# EAGLE design R107 (EAGLE 6.6.0)
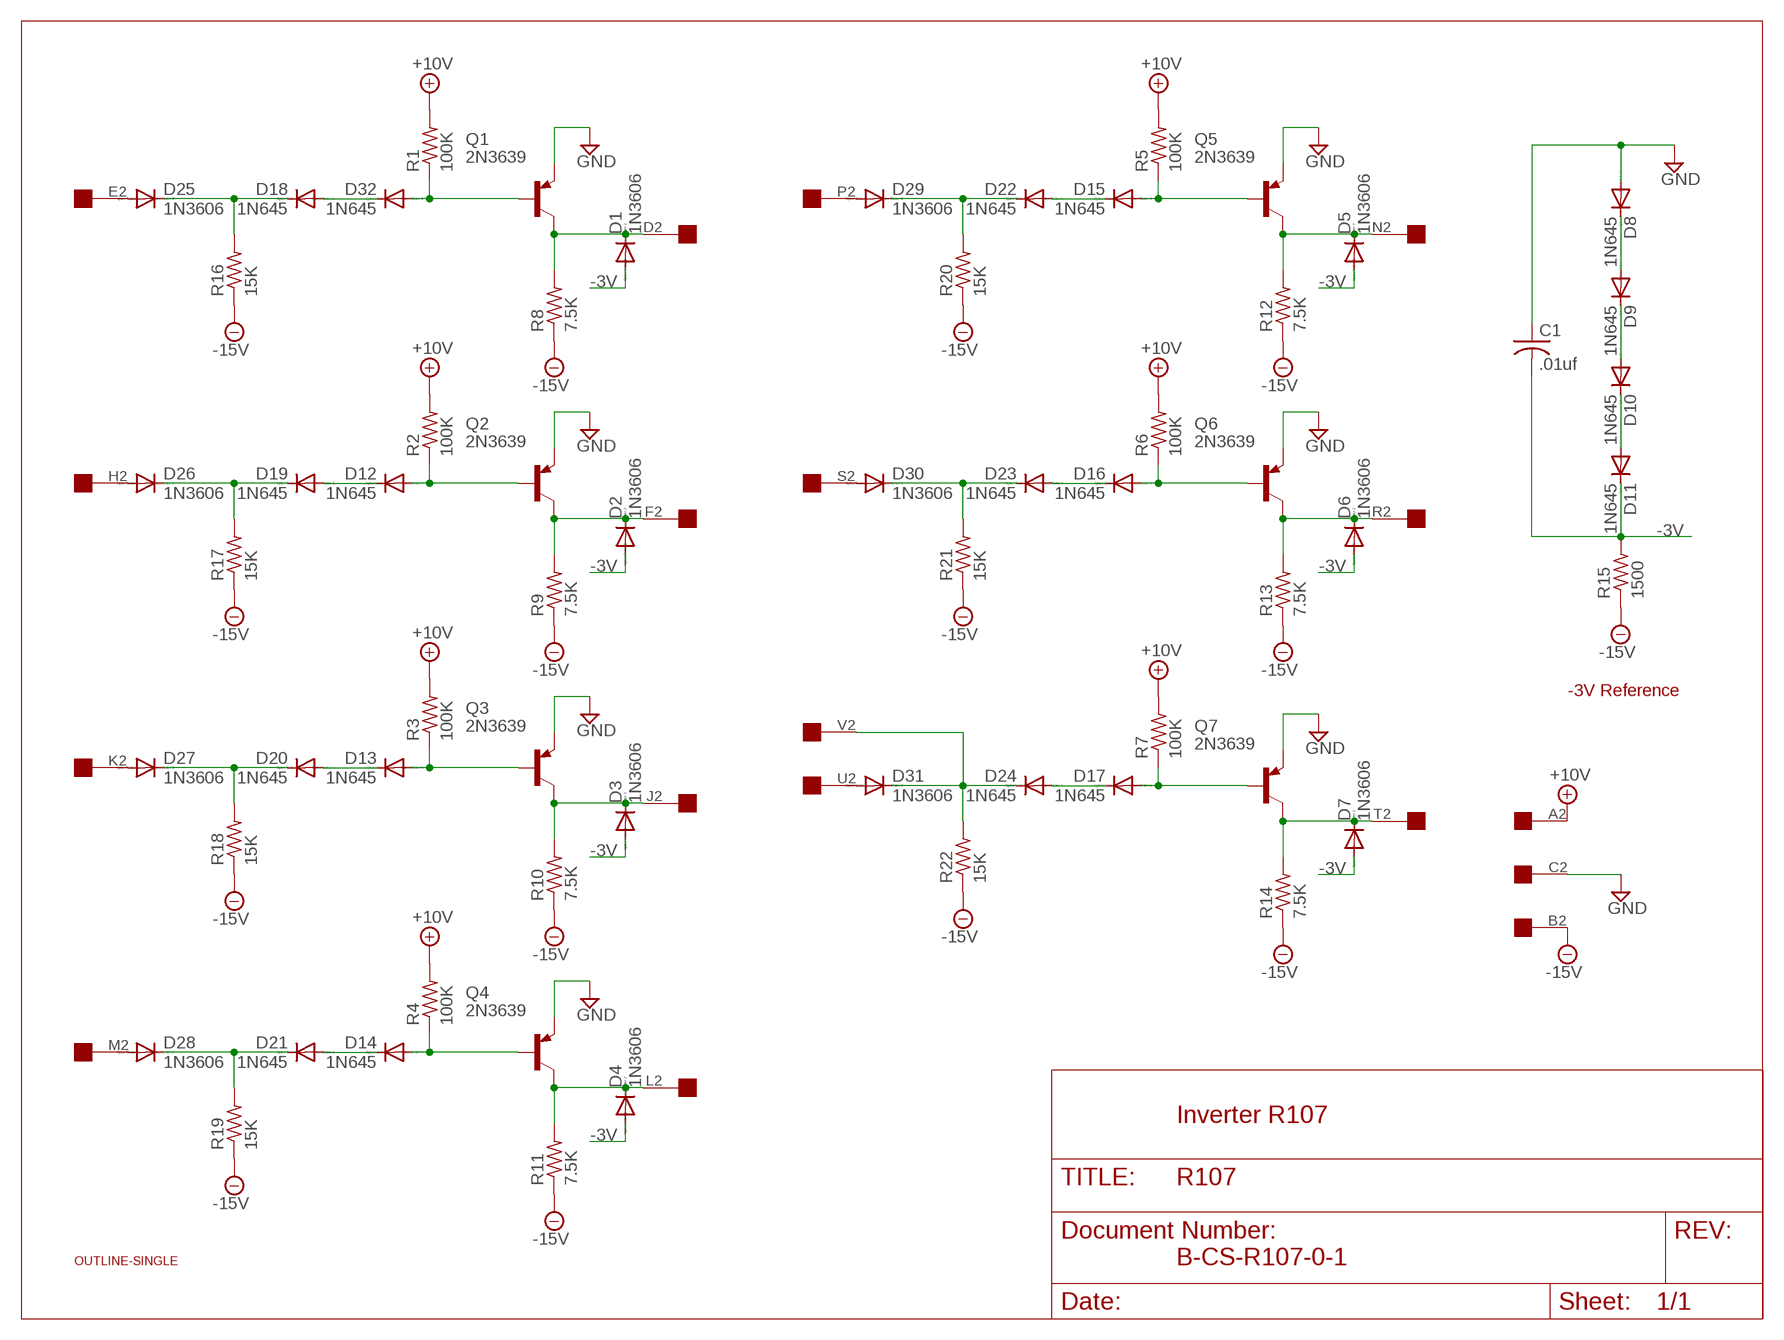
[diagram p0: schematic, sheet 1]

## Parts
C1  .01uf  C-US050-025X075  [C050-025X075]
D1  1N3606  1N4148DO35-10  [DO35-10]
D2  1N3606  1N4148DO35-10  [DO35-10]
D3  1N3606  1N4148DO35-10  [DO35-10]
D4  1N3606  1N4148DO35-10  [DO35-10]
D5  1N3606  1N4148DO35-10  [DO35-10]
D6  1N3606  1N4148DO35-10  [DO35-10]
D7  1N3606  1N4148DO35-10  [DO35-10]
D8  1N645  1N4148DO35-10  [DO35-10]
D9  1N645  1N4148DO35-10  [DO35-10]
D10  1N645  1N4148DO35-10  [DO35-10]
D11  1N645  1N4148DO35-10  [DO35-10]
D12  1N645  1N4148DO35-10  [DO35-10]
D13  1N645  1N4148DO35-10  [DO35-10]
D14  1N645  1N4148DO35-10  [DO35-10]
D15  1N645  1N4148DO35-10  [DO35-10]
D16  1N645  1N4148DO35-10  [DO35-10]
D17  1N645  1N4148DO35-10  [DO35-10]
D18  1N645  1N4148DO35-10  [DO35-10]
D19  1N645  1N4148DO35-10  [DO35-10]
D20  1N645  1N4148DO35-10  [DO35-10]
D21  1N645  1N4148DO35-10  [DO35-10]
D22  1N645  1N4148DO35-10  [DO35-10]
D23  1N645  1N4148DO35-10  [DO35-10]
D24  1N645  1N4148DO35-10  [DO35-10]
D25  1N3606  1N4148DO35-10  [DO35-10]
D26  1N3606  1N4148DO35-10  [DO35-10]
D27  1N3606  1N4148DO35-10  [DO35-10]
D28  1N3606  1N4148DO35-10  [DO35-10]
D29  1N3606  1N4148DO35-10  [DO35-10]
D30  1N3606  1N4148DO35-10  [DO35-10]
D31  1N3606  1N4148DO35-10  [DO35-10]
D32  1N645  1N4148DO35-10  [DO35-10]
Q1  2N3639  2N3637  [TO39]
Q2  2N3639  2N3637  [TO39]
Q3  2N3639  2N3637  [TO39]
Q4  2N3639  2N3637  [TO39]
Q5  2N3639  2N3637  [TO39]
Q6  2N3639  2N3637  [TO39]
Q7  2N3639  2N3637  [TO39]
R1  100K  R-US_0207/10  [0207/10]
R2  100K  R-US_0207/10  [0207/10]
R3  100K  R-US_0207/10  [0207/10]
R4  100K  R-US_0207/10  [0207/10]
R5  100K  R-US_0207/10  [0207/10]
R6  100K  R-US_0207/10  [0207/10]
R7  100K  R-US_0207/10  [0207/10]
R8  7.5K  R-US_0207/10  [0207/10]
R9  7.5K  R-US_0207/10  [0207/10]
R10  7.5K  R-US_0207/10  [0207/10]
R11  7.5K  R-US_0207/10  [0207/10]
R12  7.5K  R-US_0207/10  [0207/10]
R13  7.5K  R-US_0207/10  [0207/10]
R14  7.5K  R-US_0207/10  [0207/10]
R15  1500  R-US_0207/10  [0207/10]
R16  15K  R-US_0207/10  [0207/10]
R17  15K  R-US_0207/10  [0207/10]
R18  15K  R-US_0207/10  [0207/10]
R19  15K  R-US_0207/10  [0207/10]
R20  15K  R-US_0207/10  [0207/10]
R21  15K  R-US_0207/10  [0207/10]
R22  15K  R-US_0207/10  [0207/10]
U$1  OUTLINE-SINGLE  [SINGLE]
U$2  EDGE-1  [EDGE-CON1]

## Nets
+10V [Power]: R1.2 R2.2 R3.2 R4.2 R5.2 R6.2 R7.2 U$2.A2
-3V [Power]: C1.2 D1.A D2.A D3.A D4.A D5.A D6.A D7.A D11.C R15.2
-15V [Power]: R8.1 R9.1 R10.1 R11.1 R12.1 R13.1 R14.1 R15.1 R16.1 R17.1 R18.1 R19.1 R20.1 R21.1 R22.1 U$2.B2
GND [Power]: C1.1 D8.A Q1.1(E) Q2.1(E) Q3.1(E) Q4.1(E) Q5.1(E) Q6.1(E) Q7.1(E) U$2.C2
N$1: D7.C Q7.3(C) R14.2 U$2.T2
N$2: D12.A Q2.2(B) R2.1
N$3: D8.C D9.A
N$4: D2.C Q2.3(C) R9.2 U$2.F2
N$5: D26.A U$2.H2
N$6: D19.C D26.C R17.2
N$7: D12.C D19.A
N$8: D13.A Q3.2(B) R3.1
N$9: D3.C Q3.3(C) R10.2 U$2.J2
N$10: D27.A U$2.K2
N$11: D20.C D27.C R18.2
N$12: D13.C D20.A
N$13: D9.C D10.A
N$14: D31.A U$2.U2
N$15: D17.A Q7.2(B) R7.1
N$16: D10.C D11.A
N$17: D24.C D31.C R22.2 U$2.V2
N$18: D17.C D24.A
N$19: D32.A Q1.2(B) R1.1
N$20: D1.C Q1.3(C) R8.2 U$2.D2
N$21: D25.A U$2.E2
N$22: D18.C D25.C R16.2
N$23: D18.A D32.C
N$24: D14.A Q4.2(B) R4.1
N$25: D4.C Q4.3(C) R11.2 U$2.L2
N$26: D28.A U$2.M2
N$27: D21.C D28.C R19.2
N$28: D14.C D21.A
N$29: D15.A Q5.2(B) R5.1
N$30: D5.C Q5.3(C) R12.2 U$2.N2
N$31: D29.A U$2.P2
N$32: D22.C D29.C R20.2
N$33: D15.C D22.A
N$34: D16.A Q6.2(B) R6.1
N$35: D6.C Q6.3(C) R13.2 U$2.R2
N$36: D30.A U$2.S2
N$37: D23.C D30.C R21.2
N$38: D16.C D23.A

## Notes on the sheet
- -3V Reference
- Inverter R107
- B-CS-R107-0-1

## Library data of the parts
C1 = rcl:C-US: CAPACITOR, American symbol
D1-D32 = diode:1N4148: DIODE high speed (Philips)
Q1-Q7 = transistor-pnp:2N3637*: PNP Transistror
R1-R22 = rcl:R-US_: RESISTOR, American symbol
U$1 = dec-con:OUTLINE-*: Board outlines for DEC boards.
U$2 = dec-con:EDGE-1: Single-Sided DEC Edge Connector -- (side 2)

## Net classes
1 Power: width 0.813 mm

## Board
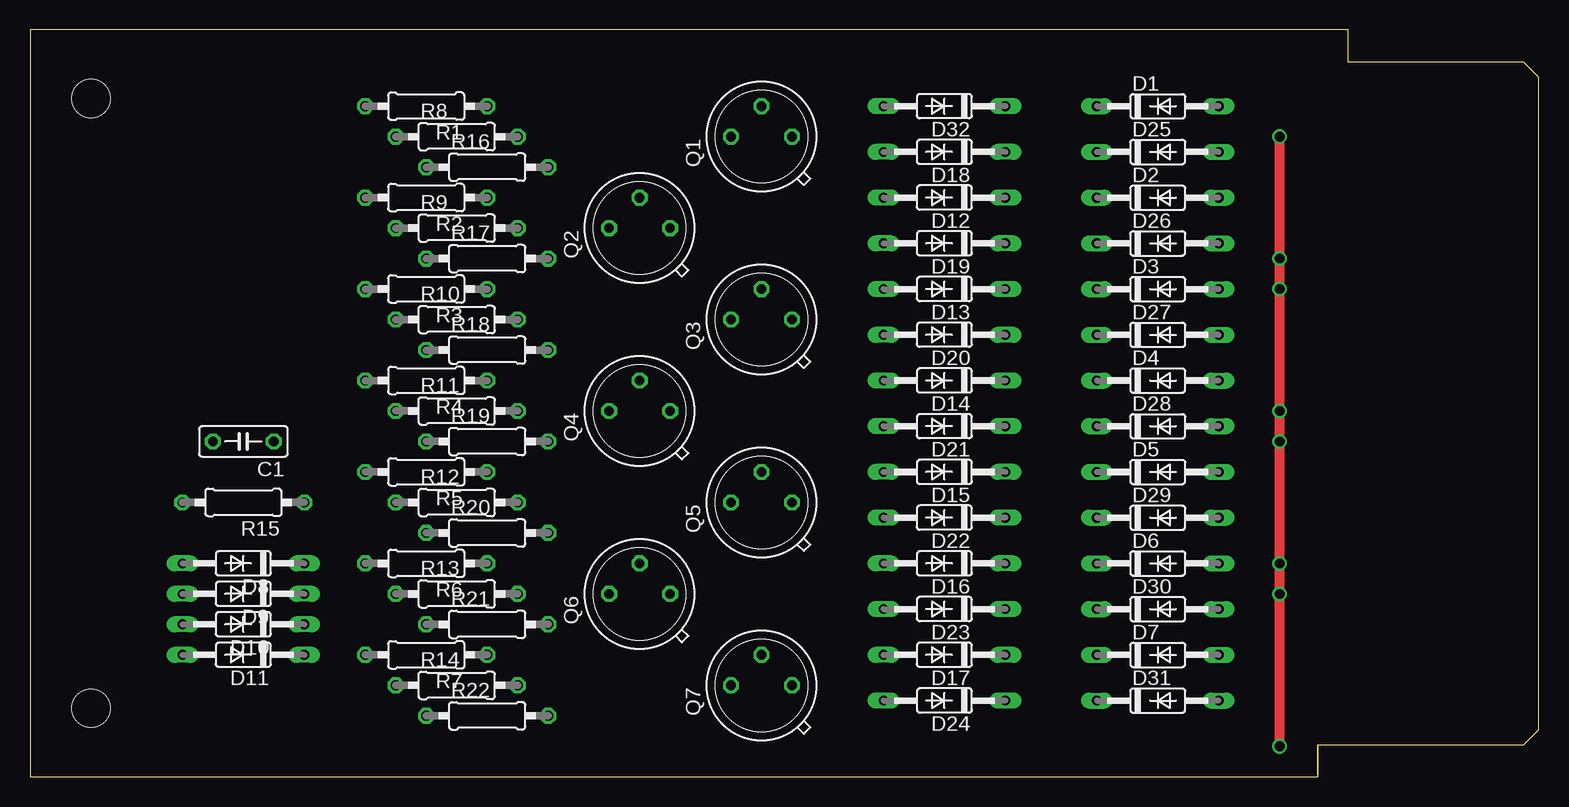
[diagram p1: board, top side]
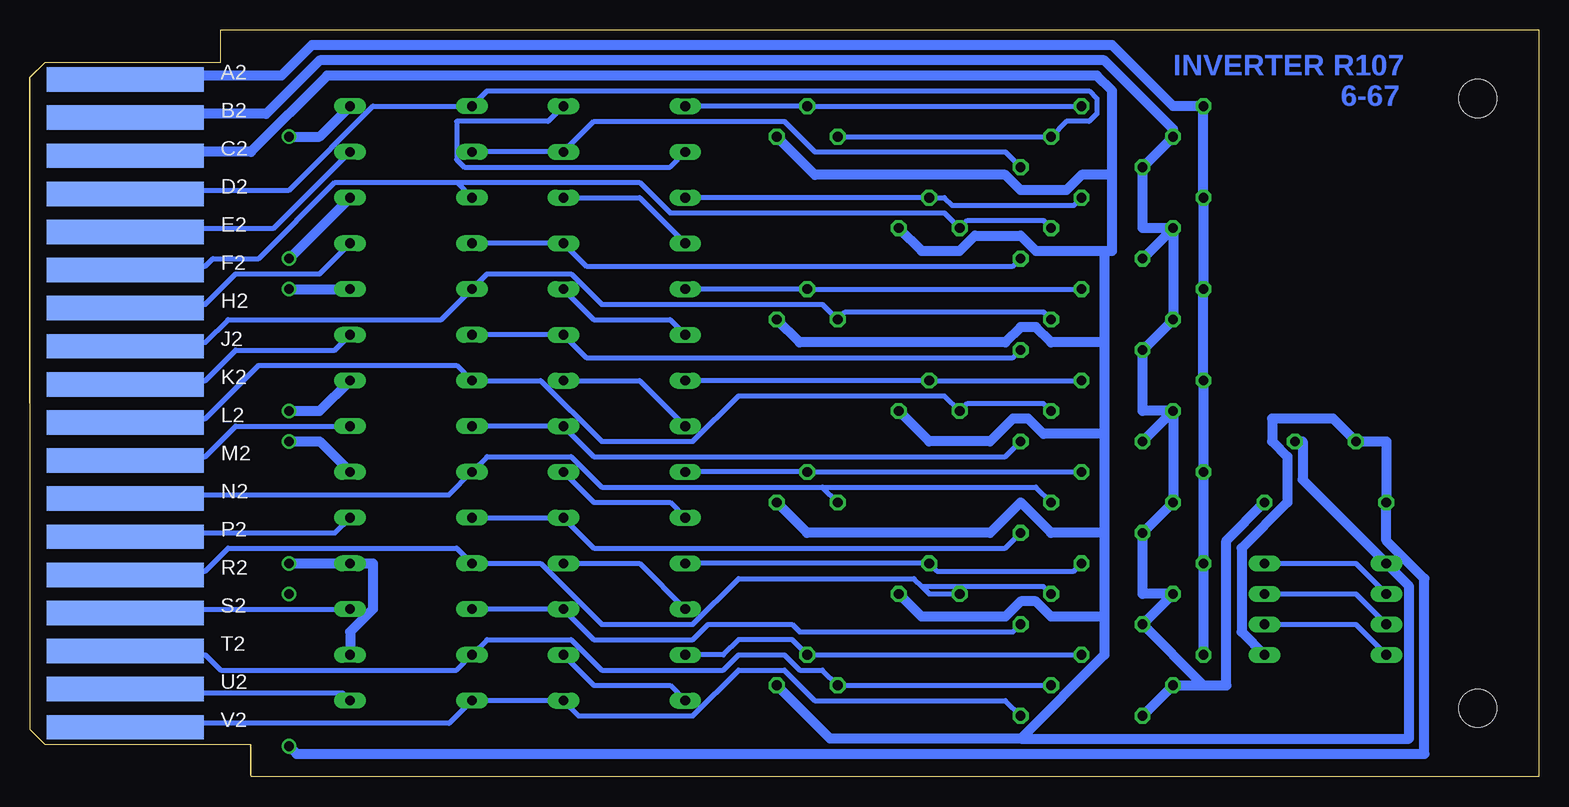
[diagram p2: board, bottom side, seen from below]

Size 125.73 x 62.23 mm. Coordinates in mm from the lower left corner, seen from the top.
Copper layers (1+16): Top 0.035mm / dielectric 1.5mm / Bottom 0.035mm
Design rules "16mils": minimum track width 16mil, minimum drill 32mil, track to track 15mil, track to pad 10mil, pad to pad 10mil, via to via 10mil, smd to smd 10mil, copper to edge 13mil, drill to drill 10mil, minimum pad ring 10mil, minimum via ring 8mil, stop-mask expansion 0mil, vias tented up to drill 0mil, thermal gap 10mil

### Footprints (pad centres in the part's own frame; a part is rotated, then mirrored left to right if it is on the bottom)
C050-025X075 = drill 0.813 octagon: 1 -2.54,0; 2 2.54,0
DO35-10 = drill 0.813 long: A 5.08,0; C -5.08,0
TO39 = drill 0.813 octagon: 1 0,-2.54; 2 2.54,0; 3 0,2.54
0207/10 = drill 0.813 octagon: 1 -5.08,0; 2 5.08,0
SINGLE = hole 3.175: 120.65,56.515; 120.65,5.715
EDGE-CON1 = smd 13.106 x 2.032 bottom: A2 7.938,4.128; B2 7.938,7.303; C2 7.938,10.477; D2 7.938,13.652; E2 7.938,16.828; F2 7.938,20.003; H2 7.938,23.177; J2 7.938,26.352; K2 7.938,29.527; L2 7.938,32.703; M2 7.938,35.877; N2 7.938,39.053; P2 7.938,42.227; R2 7.938,45.403; S2 7.938,48.578; T2 7.938,51.752; U2 7.938,54.928; V2 7.938,58.102

### Placement (x,y rotation side)
C1  17.78,27.94 180 top
D1  93.98,55.88 0 top
D2  93.98,48.26 0 top
D3  93.98,40.64 0 top
D4  93.98,33.02 0 top
D5  93.98,25.4 0 top
D6  93.98,17.78 0 top
D7  93.98,10.16 0 top
D8  17.78,17.78 180 top
D9  17.78,15.24 180 top
D10  17.78,12.7 180 top
D11  17.78,10.16 180 top
D12  76.2,48.26 180 top
D13  76.2,40.64 180 top
D14  76.2,33.02 180 top
D15  76.2,25.4 180 top
D16  76.2,17.78 180 top
D17  76.2,10.16 180 top
D18  76.2,52.07 180 top
D19  76.2,44.45 180 top
D20  76.2,36.83 180 top
D21  76.2,29.21 180 top
D22  76.2,21.59 180 top
D23  76.2,13.97 180 top
D24  76.2,6.35 180 top
D25  93.98,52.07 0 top
D26  93.98,44.45 0 top
D27  93.98,36.83 0 top
D28  93.98,29.21 0 top
D29  93.98,21.59 0 top
D30  93.98,13.97 0 top
D31  93.98,6.35 0 top
D32  76.2,55.88 180 top
Q1  60.96,53.34 90 top
Q2  50.8,45.72 90 top
Q3  60.96,38.1 90 top
Q4  50.8,30.48 90 top
Q5  60.96,22.86 90 top
Q6  50.8,15.24 90 top
Q7  60.96,7.62 90 top
R1  33.02,55.88 180 top
R2  33.02,48.26 180 top
R3  33.02,40.64 180 top
R4  33.02,33.02 180 top
R5  33.02,25.4 180 top
R6  33.02,17.78 180 top
R7  33.02,10.16 180 top
R8  35.56,53.34 0 top
R9  35.56,45.72 0 top
R10  35.56,38.1 0 top
R11  35.56,30.48 0 top
R12  35.56,22.86 0 top
R13  35.56,15.24 0 top
R14  35.56,7.62 0 top
R15  17.78,22.86 180 top
R16  38.1,50.8 0 top
R17  38.1,43.18 0 top
R18  38.1,35.56 0 top
R19  38.1,27.94 0 top
R20  38.1,20.32 0 top
R21  38.1,12.7 0 top
R22  38.1,5.08 0 top
U$1  125.73,62.23 180 top
U$2  125.73,62.23 180 top

### Tracks (layer width: path | path; a pad name or v marks a point on that pad's centre or on a via)
+10V
  Bottom 0.813: R7.2 R6.2 R5.2 R4.2 R3.2 R2.2 R1.2 30.48,55.88 35.56,60.96 102.23,60.96 104.78,58.42 117.47,58.42 U$2.A2
-3V  (via drill 0.81)
  Top 0.813: v104.14,2.54 v104.14,15.24 v104.14,17.78 v104.14,27.94 v104.14,30.48 v104.14,40.64 v104.14,43.18 v104.14,53.34
  Bottom 0.813: D11.C 24.77,12.06 24.77,19.05 20.95,22.86 20.95,26.67 22.23,27.94 22.23,29.84 17.14,29.84 C1.2 12.7,27.94 R15.2 12.7,19.68 9.53,16.51 9.53,1.91 103.5,1.91 v104.14,2.54 | D7.A 99.06,12.06 97.16,13.97 97.16,17.78 D6.A v104.14,17.78 | D5.A 101.6,27.94 v104.14,27.94 | D4.A 101.6,30.48 v104.14,30.48 | v104.14,40.64 D3.A | v104.14,43.18 D2.A | D1.A 101.6,53.34 v104.14,53.34
-15V
  Bottom 0.813: R17.1 R9.1 | R9.1 R10.1 R18.1 33.02,30.48 R11.1 | R9.1 33.02,45.72 R16.1 R8.1 30.48,53.98 36.2,59.69 101.6,59.69 106.05,55.24 117.47,55.24 U$2.B2 | R19.1 R11.1 | R11.1 R12.1 R20.1 33.02,15.24 R13.1 R21.1 27.94,7.62 | R22.1 R14.1 27.94,7.62 | R15.1 26.04,19.68 26.04,7.62 27.94,7.62
GND
  Bottom 0.813: C1.1 19.68,27.94 19.68,24.77 D8.A 10.79,15.88 10.79,3.17 43.18,3.17 | 36.2,43.81 36.2,36.2 | 36.2,43.81 41.91,43.81 43.18,45.09 46.99,45.09 48.26,43.81 51.44,43.81 Q2.1 | Q7.1 59.05,3.17 43.18,3.17 | 43.18,3.17 36.2,10.16 36.2,13.34 | 36.2,36.2 36.2,28.57 | 36.2,28.57 36.2,20.32 | 36.2,20.32 36.2,13.34 | Q3.1 61.59,36.2 44.45,36.2 43.18,37.47 41.91,37.47 40.64,36.2 36.2,36.2 | Q5.1 60.96,20.32 45.72,20.32 43.18,22.86 40.64,20.32 36.2,20.32 | 35.56,50.16 35.56,43.81 36.2,43.81 | 35.56,50.16 35.56,57.15 36.83,58.42 100.97,58.42 107.31,52.07 117.47,52.07 U$2.C2 | Q1.1 60.33,50.16 44.45,50.16 43.18,48.9 39.37,48.9 38.1,50.16 35.56,50.16 | Q4.1 50.8,27.94 45.72,27.94 43.81,29.84 42.55,29.84 41.27,28.57 36.2,28.57 | Q6.1 51.44,13.34 44.45,13.34 43.18,14.61 41.91,14.61 40.64,13.34 36.2,13.34
N$1
  Bottom 0.406: R14.2 Q7.3 59.69,8.89 61.59,8.89 62.87,10.16 66.67,10.16 67.94,8.89 78.11,8.89 80.64,11.43 87.63,11.43 D7.C 90.17,8.89 109.86,8.89 111.12,10.16 117.47,10.16 U$2.T2
N$2
  Bottom 0.406: D12.A Q2.2 49.53,48.26 48.9,47.62 38.73,47.62 R2.1
N$3
  Bottom 0.406: D9.A 15.24,17.78 D8.C
N$4
  Bottom 0.406: R9.2 41.27,46.35 47.62,46.35 Q2.3 49.53,46.99 72.39,46.99 74.93,49.53 90.17,49.53 | 90.17,49.53 D2.C | 90.17,49.53 100.33,49.53 106.68,43.18 110.49,43.18 111.12,42.55 117.47,42.55 U$2.F2
N$5
  Bottom 0.406: D26.A 101.6,41.91 108.58,41.91 111.12,39.37 117.47,39.37 U$2.H2
N$6
  Bottom 0.406: R17.2 43.81,42.55 79.38,42.55 D19.C D26.C
N$7
  Bottom 0.406: D19.A 74.93,48.26 D12.C
N$8
  Bottom 0.406: R3.1 Q3.2 D13.A
N$9
  Bottom 0.406: R10.2 41.27,38.73 57.78,38.73 Q3.3 59.69,39.37 78.11,39.37 80.64,41.91 87.63,41.91 D3.C 91.44,38.1 109.22,38.1 111.12,36.2 117.47,36.2 U$2.J2
N$10
  Bottom 0.406: D27.A 100.33,35.56 108.58,35.56 111.12,33.02 117.47,33.02 U$2.K2
N$11
  Bottom 0.406: R18.2 43.81,34.92 79.38,34.92 D20.C D27.C
N$12
  Bottom 0.406: D20.A 72.39,38.1 78.74,38.1 D13.C
N$13
  Bottom 0.406: D10.A 15.24,15.24 D9.C
N$14
  Bottom 0.406: D31.A 99.69,6.99 117.47,6.99 U$2.U2
N$15
  Bottom 0.406: R7.1 Q7.2 62.23,11.43 66.67,11.43 67.94,10.16 D17.A
N$16
  Bottom 0.406: D11.A 15.24,12.7 D10.C
N$17
  Bottom 0.406: R22.2 44.45,6.35 60.33,6.35 62.87,8.89 66.67,8.89 70.48,5.08 80.01,5.08 D24.C D31.C 90.81,4.45 117.47,4.45 U$2.V2
N$18
  Bottom 0.406: D24.A 72.39,7.62 78.74,7.62 D17.C
N$19
  Bottom 0.406: R1.1 Q1.2 D32.A
N$20
  Bottom 0.406: Q1.3 R8.2 39.37,54.61 37.47,54.61 36.83,55.24 36.83,56.52 37.47,57.15 87.63,57.15 D1.C 97.16,55.88 104.14,48.9 117.47,48.9 U$2.D2
N$21
  Bottom 0.406: D25.A 105.41,45.72 117.47,45.72 U$2.E2
N$22
  Bottom 0.406: R16.2 44.45,52.07 60.33,52.07 62.87,54.61 78.74,54.61 D18.C D25.C
N$23
  Bottom 0.406: D18.A 72.39,50.8 89.53,50.8 90.17,51.44 90.17,54.61 82.55,54.61 D32.C
N$24
  Bottom 0.406: R4.1 Q4.2 D14.A
N$25
  Bottom 0.406: U$2.L2 117.47,29.84 111.12,29.84 106.68,34.29 90.17,34.29 D4.C 83.19,33.02 78.11,27.94 70.48,27.94 66.67,31.75 49.53,31.75 Q4.3 47.62,31.11 41.27,31.11 R11.2
N$26
  Bottom 0.406: D28.A 108.58,29.21 111.12,26.67 117.47,26.67 U$2.M2
N$27
  Bottom 0.406: D28.C D21.C 78.74,26.67 44.45,26.67 R19.2
N$28
  Bottom 0.406: D21.A 74.93,33.02 D14.C
N$29
  Bottom 0.406: D15.A Q5.2 R5.1
N$30
  Bottom 0.406: U$2.N2 117.47,23.5 90.81,23.5 D5.C 87.63,26.67 80.64,26.67 78.11,24.13 59.69,24.13 | 59.69,24.13 Q5.3 | R12.2 41.91,24.13 59.69,24.13
N$31
  Bottom 0.406: D29.A 100.33,20.32 117.47,20.32 U$2.P2
N$32
  Bottom 0.406: D29.C D22.C 78.74,19.05 44.45,19.05 R20.2
N$33
  Bottom 0.406: D22.A 72.39,22.86 78.74,22.86 D15.C
N$34
  Bottom 0.406: R6.1 38.73,17.14 50.16,17.14 Q6.2 D16.A
N$35
  Bottom 0.406: U$2.R2 117.47,17.14 111.12,17.14 109.22,19.05 90.17,19.05 D6.C 83.19,17.78 78.11,12.7 70.48,12.7 66.67,16.51 52.07,16.51 51.44,15.88 | 51.44,15.88 50.8,15.24 Q6.3 | R13.2 41.27,15.88 51.44,15.88
N$36
  Bottom 0.406: D30.A 117.47,13.97 U$2.S2
N$37
  Bottom 0.406: D30.C D23.C 78.74,11.43 70.48,11.43 69.22,12.7 62.23,12.7 61.59,12.06 43.81,12.06 R21.2
N$38
  Bottom 0.406: D23.A 74.93,17.78 D16.C

### Text on the board
Bottom: INVERTER R107 | 6-67